# Altium schematic sheet Motor_Board_Connector.SchDoc
size A4; Organization: ENEL429 Group N; Address1: ECE Department; Address2: University of Canterbury; Address3: Christchurch 8041; Address4: New Zealand; Revision: 1
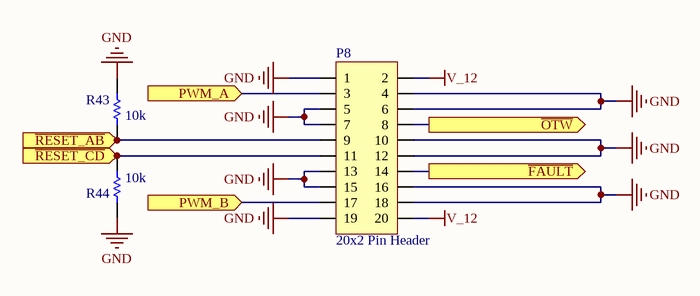
[diagram p0: Motor_Board_Connector.SchDoc]

## Parts
P8  20x2 Pin Header  [G_HDR2X10]
R43  10k  [0603]
R44  10k  [0603]

## Ports
PWM_A (in), PWM_B (in), ~{FAULT} (out), ~{OTW} (out), ~{RESET_AB} (in), ~{RESET_CD} (in)

## Nets
GND: P8.1 P8.4 P8.5 P8.6 P8.7 P8.10 P8.12 P8.13 P8.15 P8.16 P8.18 P8.19 R43.2 R44.1
V_12: P8.2 P8.20
~{FAULT}: P8.14 ; port ~{FAULT}
~{OTW}: P8.8 ; port ~{OTW}
PWM_A: P8.3 ; port PWM_A
PWM_B: P8.17 ; port PWM_B
~{RESET_AB}: P8.9 R43.1 ; port ~{RESET_AB}
~{RESET_CD}: P8.11 R44.2 ; port ~{RESET_CD}

## Notes on the sheet
- Title
- Drawn by:
- Date:
- Time:
- Revision:
- Sheet
- of
- File:

## Library data of the parts
P8 = JP_20x2 PIN_HDR_WALL: CONN HEADER 20 POS STRGHT GOLD; Manufacturer: 3M; Manufacturer PN: N2520-6002RB; LatestRevisionDate: 2 Jun 08; Supplier 1: Digi-Key; Supplier Part Number 1: MHC20K-ND; Value: 20x2 Pin Header; Part Number: JP_20x2 PIN_HDR_WALL; Component Kind: Standard; Component Type: Standard; Designator: JP_20x2 PIN_HDR_WALL; Pin Count: 20
R43 R44 = RS_10k 0603: RES 10.0K OHM 1/10W 1% 0603 SMD; Manufacturer: Yageo; Manufacturer PN: RC0603FR-0710KL; LatestRevisionDate: 29 May 08; Supplier 1: Digi-Key; Supplier Part Number 1: 311-10.0KHRTR-ND; Value: 10k; Part Number: RS_10k 0603; Component Kind: Standard; Component Type: Standard; Designator: RS_10k 0603; Pin Count: 2; Signal Integrity: Res; Simulation: RESISTOR